# Altium schematic sheet Power.SchDoc: Power
size Letter; Engineer: Nathan Petersen; DocumentNumber: 3; Revision: v1.2; SheetNumber: 3; SheetTotal: 23
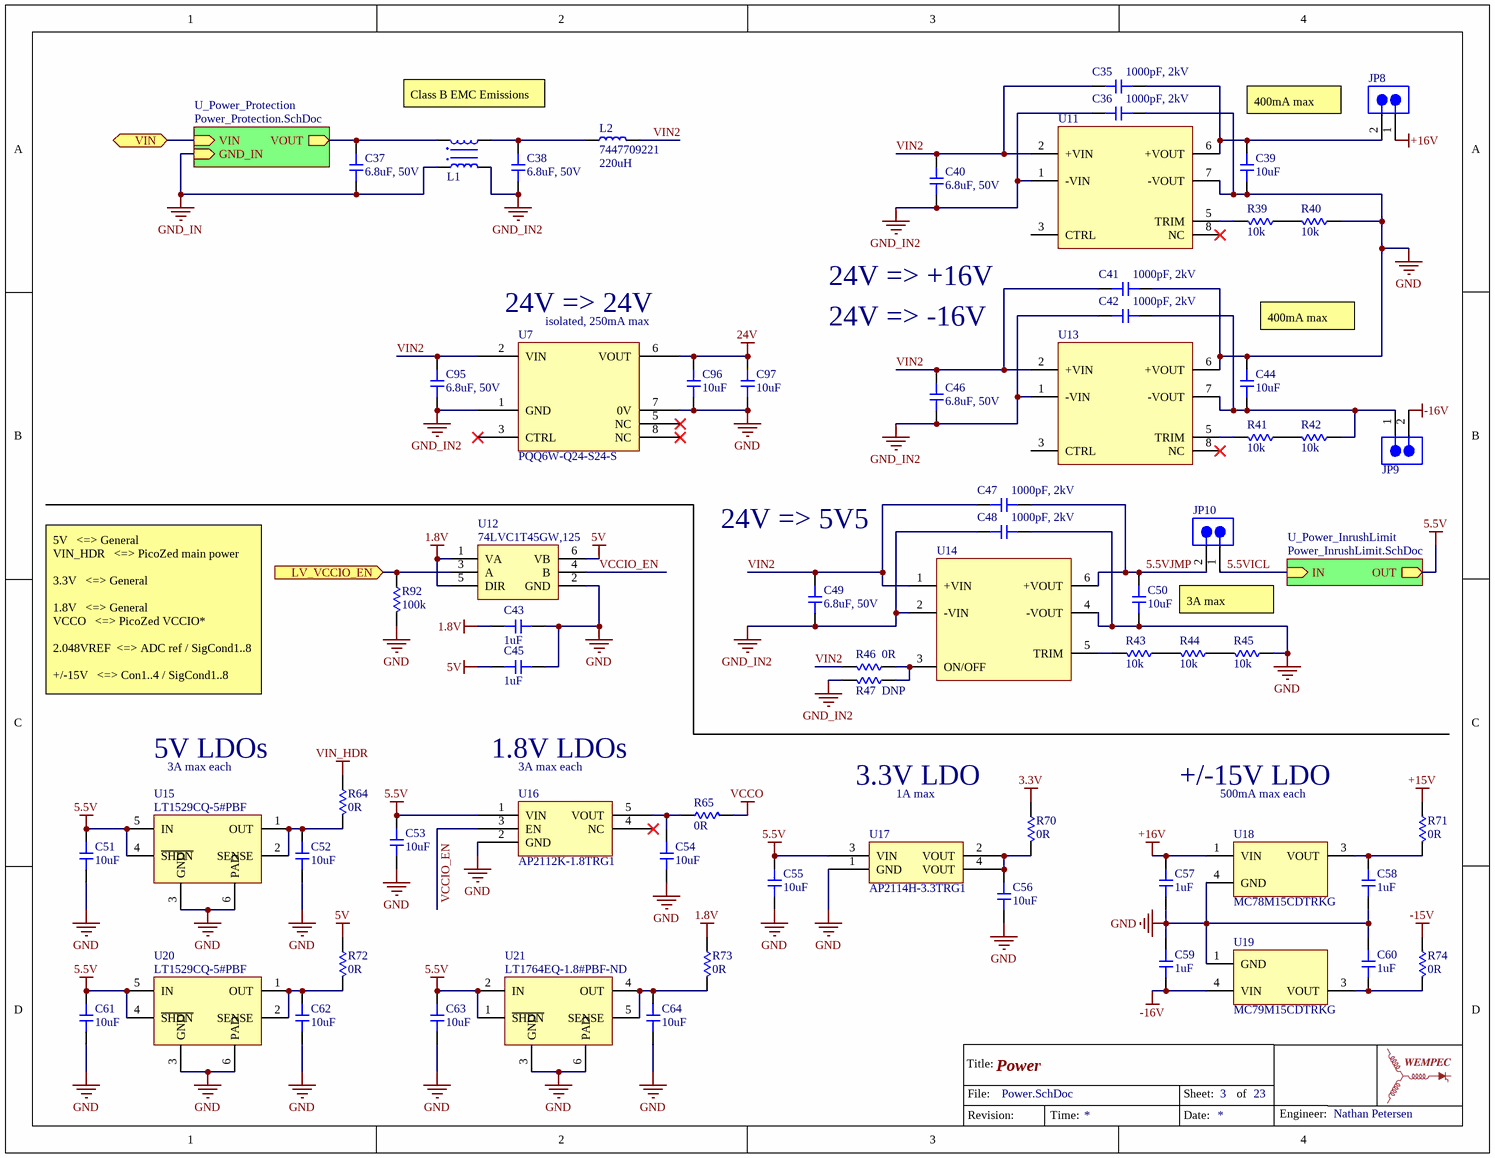
[diagram p0: Power.SchDoc]

## Parts
C35  value 1000pF, 2kV  [1808-CAP]  (hidden comment: Capacitor)
C36  value 1000pF, 2kV  [1808-CAP]  (hidden comment: Capacitor)
C37  value 6.8uF, 50V  [1812-CAP]  (hidden comment: Capacitor)
C38  value 6.8uF, 50V  [1812-CAP]  (hidden comment: Capacitor)
C39  value 10uF  [0603-CAP]  (hidden comment: Capacitor)
C40  value 6.8uF, 50V  [1812-CAP]  (hidden comment: Capacitor)
C41  value 1000pF, 2kV  [1808-CAP]  (hidden comment: Capacitor)
C42  value 1000pF, 2kV  [1808-CAP]  (hidden comment: Capacitor)
C43  value 1uF  [0603-CAP]  (hidden comment: Capacitor)
C44  value 10uF  [0603-CAP]  (hidden comment: Capacitor)
C45  value 1uF  [0603-CAP]  (hidden comment: Capacitor)
C46  value 6.8uF, 50V  [1812-CAP]  (hidden comment: Capacitor)
C47  value 1000pF, 2kV  [1808-CAP]  (hidden comment: Capacitor)
C48  value 1000pF, 2kV  [1808-CAP]  (hidden comment: Capacitor)
C49  value 6.8uF, 50V  [1812-CAP]  (hidden comment: Capacitor)
C50  value 10uF  [0603-CAP]  (hidden comment: Capacitor)
C51  value 10uF  [0603-CAP]  (hidden comment: Capacitor)
C52  value 10uF  [0603-CAP]  (hidden comment: Capacitor)
C53  value 10uF  [0603-CAP]  (hidden comment: Capacitor)
C54  value 10uF  [0603-CAP]  (hidden comment: Capacitor)
C55  value 10uF  [0603-CAP]  (hidden comment: Capacitor)
C56  value 10uF  [0603-CAP]  (hidden comment: Capacitor)
C57  value 1uF  [0603-CAP]  (hidden comment: Capacitor)
C58  value 1uF  [0603-CAP]  (hidden comment: Capacitor)
C59  value 1uF  [0603-CAP]  (hidden comment: Capacitor)
C60  value 1uF  [0603-CAP]  (hidden comment: Capacitor)
C61  value 10uF  [0603-CAP]  (hidden comment: Capacitor)
C62  value 10uF  [0603-CAP]  (hidden comment: Capacitor)
C63  value 10uF  [0603-CAP]  (hidden comment: Capacitor)
C64  value 10uF  [0603-CAP]  (hidden comment: Capacitor)
C95  value 6.8uF, 50V  [1812-CAP]  (hidden comment: Capacitor)
C96  value 10uF  [0603-CAP]  (hidden comment: Capacitor)
C97  value 10uF  [0603-CAP]  (hidden comment: Capacitor)
JP8  Jumper2  [PIN_HEADER_1x2]  (value not drawn)
JP9  Jumper2  [PIN_HEADER_1x2]  (value not drawn)
JP10  Jumper2  [PIN_HEADER_1x2]  (value not drawn)
L1  CMC  744273801  [CMC 744273801]  (value not drawn)
L2  7447709221  value 220uH  [7447709221]
R39  value 10k  [0603-RES]  (hidden comment: Resistor)
R40  value 10k  [0603-RES]  (hidden comment: Resistor)
R41  value 10k  [0603-RES]  (hidden comment: Resistor)
R42  value 10k  [0603-RES]  (hidden comment: Resistor)
R43  value 10k  [0603-RES]  (hidden comment: Resistor)
R44  value 10k  [0603-RES]  (hidden comment: Resistor)
R45  value 10k  [0603-RES]  (hidden comment: Resistor)
R46  value 0R  [1206-RES]  (hidden comment: Resistor)
R47  value DNP  [1206-RES]  (hidden comment: Resistor)
R64  value 0R  [1206-RES]  (hidden comment: Resistor)
R65  value 0R  [1206-RES]  (hidden comment: Resistor)
R70  value 0R  [1206-RES]  (hidden comment: Resistor)
R71  value 0R  [1206-RES]  (hidden comment: Resistor)
R72  value 0R  [1206-RES]  (hidden comment: Resistor)
R73  value 0R  [1206-RES]  (hidden comment: Resistor)
R74  value 0R  [1206-RES]  (hidden comment: Resistor)
R92  value 100k  [0603-RES]  (hidden comment: Resistor)
U7  PQQ6W-Q24-S24-S  [PQQ6W-Q24-S24-S]
U11  DCDC Converter RS6  [RS6 DCDC]  (value not drawn)
U12  74LVC1T45GW,125  [SOT65P210X110-6N]
U13  DCDC Converter RS6  [RS6 DCDC]  (value not drawn)
U14  SHHD003A0A4Z  [DCDC SHHD003A0A41-SRZ]  (value not drawn)
U15  LT1529CQ-5#PBF  [5-DDPAK]
U16  AP2112K-1.8TRG1  [SOT95P280X145-5N]
U17  AP2114H-3.3TRG1  [SOT230P700X180-4N]
U18  MC78M15CDTRKG  [DPAK229P991X238-3N]
U19  MC79M15CDTRKG  [DPAK229P991X238-3N]
U20  LT1529CQ-5#PBF  [5-DDPAK]
U21  LT1764EQ-1.8#PBF-ND  [5-DDPAK]

## Sub-sheets
U_Power_InrushLimit = Power_InrushLimit.SchDoc: IN (in), OUT (out)
U_Power_Protection = Power_Protection.SchDoc: VIN (in), VOUT (out), GND_IN (in)

## Ports
LV_VCCIO_EN (in), VIN (bidir)

## Nets
1.8V: C43.1 R73.1 U12.1(VA) U12.5(DIR)
3.3V: R70.1
5.5V: C51.1 C53.1 C55.1 C61.1 C63.1 U15.4(~{SHDN}) U15.5(IN) U16.1(VIN) U17.3(VIN) U20.4(~{SHDN}) U20.5(IN) U21.1(~{SHDN}) U21.2(IN) ; sheet U_Power_InrushLimit/OUT
5V: C45.1 R72.1 U12.6(VB)
24V: C96.2 C97.2 U7.6(VOUT)
+15V: R71.1
+16V: C57.2 JP8.1 U18.1(VIN)
-15V: R74.1
-16V: C59.1 JP9.2 U19.4(VIN)
GND: C36.2 C39.1 C41.2 C43.2 C44.2 C45.2 C48.2 C50.1 C51.2 C52.2 C53.2 C54.2 C55.2 C56.2 C57.1 C58.1 C59.2 C60.2 C61.2 C62.2 C63.2 C64.2 C96.1 C97.1 R40.1 R45.1 R92.2 U7.7(0V) U11.7(-VOUT) U12.2(GND) U13.6(+VOUT) U14.4(-VOUT) U15.3(GND) U15.6(PAD) U16.2(GND) U17.1(GND) U18.4(GND) U19.1(GND) U20.3(GND) U20.6(PAD) U21.3(GND) U21.6(PAD)
GND_IN: C37.1 L1.2 ; sheet U_Power_Protection/GND_IN
GND_IN2: C36.1 C38.1 C40.1 C42.1 C46.1 C48.1 C49.1 C95.1 L1.3 R47.2 U7.1(GND) U11.1(-VIN) U13.1(-VIN) U14.2(-VIN)
VCCO: R65.2
VIN_HDR: R64.1
5.5VICL: JP10.1 ; sheet U_Power_InrushLimit/IN
5.5VJMP: C47.2 C50.2 JP10.2 U14.6(+VOUT)
LV_VCCIO_EN: R92.1 U12.3(A) ; port LV_VCCIO_EN
VCCIO_EN: U12.4(B) U16.3(EN)
VIN: port VIN, sheet U_Power_Protection/VIN
VIN2: C35.1 C40.2 C41.1 C46.2 C47.1 C49.2 C95.2 L2.1 R46.2 U7.2(VIN) U11.2(+VIN) U13.2(+VIN) U14.1(+VIN)
NetC35_2: C35.2 C39.2 JP8.2 U11.6(+VOUT)
NetC37_2: C37.2 L1.1 ; sheet U_Power_Protection/VOUT
NetC38_2: C38.2 L1.4 L2.2
NetC42_2: C42.2 C44.1 JP9.1 R42.1 U13.7(-VOUT)
NetC52_1: C52.1 R64.2 U15.1(OUT) U15.2(SENSE)
NetC54_1: C54.1 R65.1 U16.5(VOUT)
NetC56_1: C56.1 R70.2 U17.2(VOUT) U17.4(VOUT)
NetC58_2: C58.2 R71.2 U18.3(VOUT)
NetC60_1: C60.1 R74.2 U19.3(VOUT)
NetC62_1: C62.1 R72.2 U20.1(OUT) U20.2(SENSE)
NetC64_1: C64.1 R73.2 U21.4(OUT) U21.5(SENSE)
NetR39_1: R39.1 R40.2
NetR39_2: R39.2 U11.5(TRIM)
NetR41_1: R41.1 R42.2
NetR41_2: R41.2 U13.5(TRIM)
NetR43_1: R43.1 R44.2
NetR43_2: R43.2 U14.5(TRIM)
NetR44_1: R44.1 R45.2
NetR46_1: R46.1 R47.1 U14.3(ON/OFF)

Not connected (* = marked no-connect by the designer): U7 3(CTRL)* 5(NC)* 8(NC)*; U11 3(CTRL) 8(NC)*; U13 3(CTRL) 8(NC)*; U16 4(NC)*

## Notes on the sheet
- Class B EMC Emissions
- 400mA max
- (near U7) 24V => 24V
- 24V => +16V
- (near U7) isolated, 250mA max
- 24V => -16V
- (near C44) 400mA max
- (near C49) 24V => 5V5
- 3A max
- 5V	  <=> General
  VIN_HDR	  <=> PicoZed main power
  3.3V	  <=> General
  1.8V	  <=> General
  VCCO	  <=> PicoZed VCCIO*
  2.048VREF  <=> ADC ref / SigCond1..8
  +/-15V	  <=> Con1..4 / SigCond1..8
- 5V LDOs
- 3A max each
- 1.8V LDOs
- (near U16) 3A max each
- 3.3V LDO
- +/-15V LDO
- 1A max
- 500mA max each
- Title:
- File:
- Sheet:
- of
- Revision:
- Time:
- Date:
- Engineer:

## Library data of the parts
L1 = CMC  744273801: CMC 450UH 6.5A 2LN TH; Supplier 1: Digi-Key; Supplier Part Number 1: 732-2215-6-ND
L2 = 7447709221: FIXED IND 220UH 1.8A 300 MOHM; Supplier Part Number 1: 732-1696-1-ND; Supplier 1: Digi-Key
U7 = PQQ6W-Q24-S24-S: DC-DC ISOLATED, 6 W, 9~36 VDC IN; Supplier 1: Digi-Key; Supplier Part Number 1: 102-PQQ6W-Q24-S24-S-ND
U11 U13 = DCDC Converter RS6: Recom RS6; Supplier 1: Digi-Key; Supplier Part Number 1: 945-2987-ND
U12 = 74LVC1T45GW,125: TXRX XLATING DUAL 3ST 6TSSOP; Supplier 1: Digi-Key; Supplier Part Number 1: 1727-4560-1-ND
U14 = DCDC Converter SHHD003A0A41Z: DC DC CONVERTER 5V 15W; Supplier 1: Digi-Key; Supplier Part Number 1: 555-1312-ND
U15 U20 = LT1529CQ-5#PBF: IC REG LINEAR 5V 3A 5DDPAK; Supplier 1: Digi-Key; Supplier Part Number 1: LT1529CQ-5#PBF-ND
U16 = AP2112K-1.8TRG1: IC REG LINEAR 1.8V 600MA SOT25; Supplier 1: Digi-Key; Supplier Part Number 1: AP2112K-1.8TRG1DICT-ND
U17 = AP2114H-3.3TRG1: IC REG LINEAR 3.3V 1A SOT223; Supplier 1: Digi-Key; Supplier Part Number 1: AP2114H-3.3TRG1DICT-ND
U18 = MC78M15CDTRKG: IC REG LINEAR 15V 500MA DPAK; Supplier 1: Digi-Key; Supplier Part Number 1: MC78M15CDTRKGOSCT-ND
U19 = MC79M15CDTRKG: IC REG LINEAR -15V 500MA DPAK; Supplier 1: Digi-Key; Supplier Part Number 1: MC79M15CDTRKGOSCT-ND
U21 = LT1764EQ-1.8#PBF-ND: IC REG LINEAR 1.8V 3A 5DDPAK; Supplier 1: Digi-Key; Supplier Part Number 1: LT1764EQ-1.8#PBF-ND
C35-C64 C95-C97 = Capacitor: Supplier 1: Digi-Key
  C35 C36 C41 C42 C47 C48: Supplier Part Number 1: 709-1046-6-ND
  C37 C38 C40 C46 C49 C95: Supplier Part Number 1: 445-3919-6-ND
  C39 C44 C50 C96 C97: Supplier Part Number 1: 445-9015-6-ND
  C43 C45 C57-C60: Supplier Part Number 1: 1276-6524-6-ND
  C51-C56 C61-C64: Supplier Part Number 1: 1276-1192-6-ND
JP8-JP10 = Jumper2: Supplier 1: Digi-Key; Supplier Part Number 1: 732-5315-ND
R39-R47 R64 R65 R70-R74 R92 = Resistor: Supplier 1: Digi-Key
  R39-R45: Supplier Part Number 1: P10.0KHCT-ND
  R46 R47 R64 R65 R70-R74: Supplier Part Number 1: 311-0.0ERCT-ND
  R92: Supplier Part Number 1: 311-100KLDCT-ND